# EAGLE design nix3SocketsFinal (EAGLE 9.2.2)
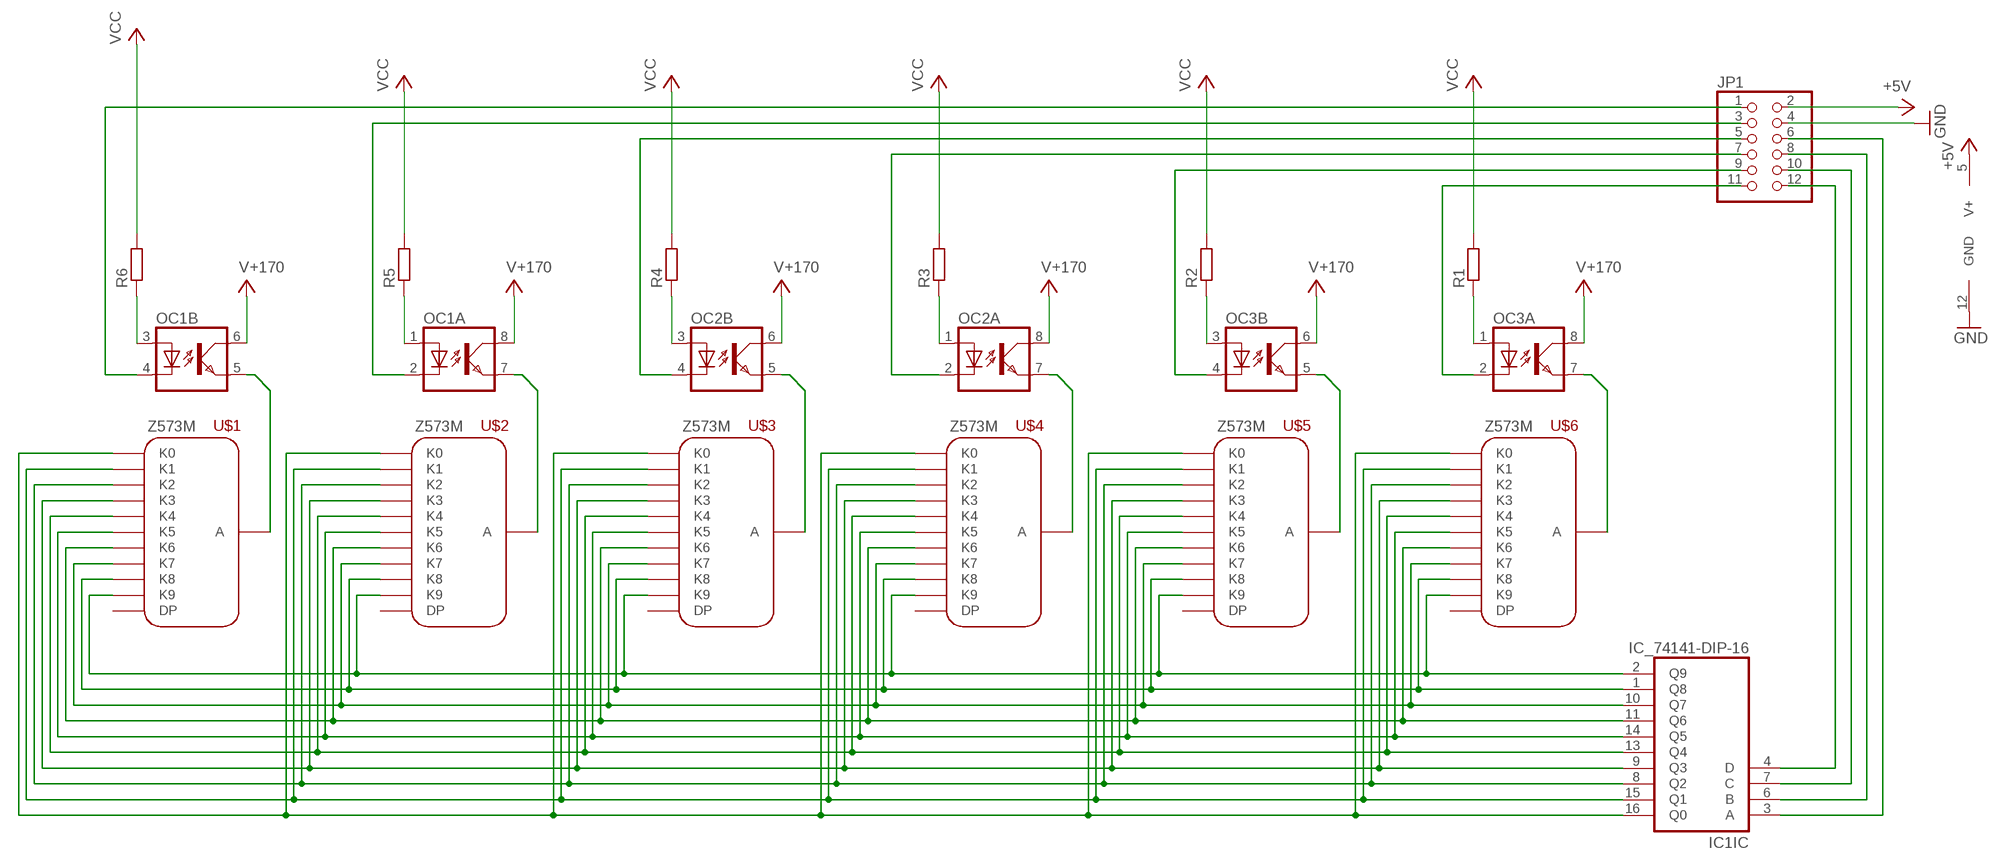
[diagram p0: schematic, sheet 1]

## Parts
IC1  IC_74141-DIP-16  [DIL16]
JP1  PINHD-2X6  [2X06]
OC1  ILD621  [DIL08]
OC2  ILD621  [DIL08]
OC3  ILD621  [DIL08]
R1  R-EU_R0805W  [R0805W]
R2  R-EU_R0805W  [R0805W]
R3  R-EU_R0805W  [R0805W]
R4  R-EU_R0805W  [R0805W]
R5  R-EU_R0805W  [R0805W]
R6  R-EU_R0805W  [R0805W]
U$1  Z573M  [Z573M]
U$2  Z573M  [Z573M]
U$3  Z573M  [Z573M]
U$4  Z573M  [Z573M]
U$5  Z573M  [Z573M]
U$6  Z573M  [Z573M]

## Nets
+5V: IC1.5(SUPPLY:V+) JP1.2 R1.2 R2.2 R3.2 R4.2 R5.2 R6.2 ; supply symbol labelled VCC
GND: IC1.12(SUPPLY:GND) JP1.4
N$2: IC1.2(IC:Q9) U$1.K9 U$2.K9 U$3.K9 U$4.K9 U$5.K9 U$6.K9
N$3: IC1.1(IC:Q8) U$1.K8 U$2.K8 U$3.K8 U$4.K8 U$5.K8 U$6.K8
N$4: IC1.10(IC:Q7) U$1.K7 U$2.K7 U$3.K7 U$4.K7 U$5.K7 U$6.K7
N$5: IC1.11(IC:Q6) U$1.K6 U$2.K6 U$3.K6 U$4.K6 U$5.K6 U$6.K6
N$6: IC1.14(IC:Q5) U$1.K5 U$2.K5 U$3.K5 U$4.K5 U$5.K5 U$6.K5
N$7: IC1.13(IC:Q4) U$1.K4 U$2.K4 U$3.K4 U$4.K4 U$5.K4 U$6.K4
N$8: IC1.9(IC:Q3) U$1.K3 U$2.K3 U$3.K3 U$4.K3 U$5.K3 U$6.K3
N$9: IC1.8(IC:Q2) U$1.K2 U$2.K2 U$3.K2 U$4.K2 U$5.K2 U$6.K2
N$10: IC1.15(IC:Q1) U$1.K1 U$2.K1 U$3.K1 U$4.K1 U$5.K1 U$6.K1
N$11: OC3.7(A:EMIT) U$6.A
N$12: IC1.16(IC:Q0) U$1.K0 U$2.K0 U$3.K0 U$4.K0 U$5.K0 U$6.K0
N$13: OC1.5(B:EMIT) U$1.A
N$14: OC1.7(A:EMIT) U$2.A
N$15: OC2.5(B:EMIT) U$3.A
N$16: OC2.7(A:EMIT) U$4.A
N$17: OC3.5(B:EMIT) U$5.A
N$18: JP1.11 OC3.2(A:C)
N$19: JP1.9 OC3.4(B:C)
N$20: JP1.7 OC2.2(A:C)
N$21: JP1.5 OC2.4(B:C)
N$22: JP1.3 OC1.2(A:C)
N$23: JP1.1 OC1.4(B:C)
N$24: IC1.4(IC:D) JP1.12
N$25: IC1.7(IC:C) JP1.10
N$26: IC1.6(IC:B) JP1.8
N$27: IC1.3(IC:A) JP1.6
N$28: OC1.3(B:A) R6.1
N$29: OC1.1(A:A) R5.1
N$30: OC2.3(B:A) R4.1
N$31: OC2.1(A:A) R3.1
N$32: OC3.3(B:A) R2.1
N$33: OC3.1(A:A) R1.1
V+: OC1.6(B:COL) OC1.8(A:COL) OC2.6(B:COL) OC2.8(A:COL) OC3.6(B:COL) OC3.8(A:COL) ; supply symbol labelled V+170
Unconnected: U$1.DP U$2.DP U$3.DP U$4.DP U$5.DP U$6.DP

## Library data of the parts
IC1 = dp_devices:IC_74141: BCD to decimal decoder
JP1 = pinhead:PINHD-2X6: PIN HEADER
OC1-OC3 = optocoupler:ILD621: SIEMENS OPTO COUPLER
R1-R6 = rcl:R-EU_: RESISTOR, European symbol
U$1-U$6 = nixie:Z573M: Z573M Nixie Tube - Designed by Mike Silverman - www.msilverman.me

## Board
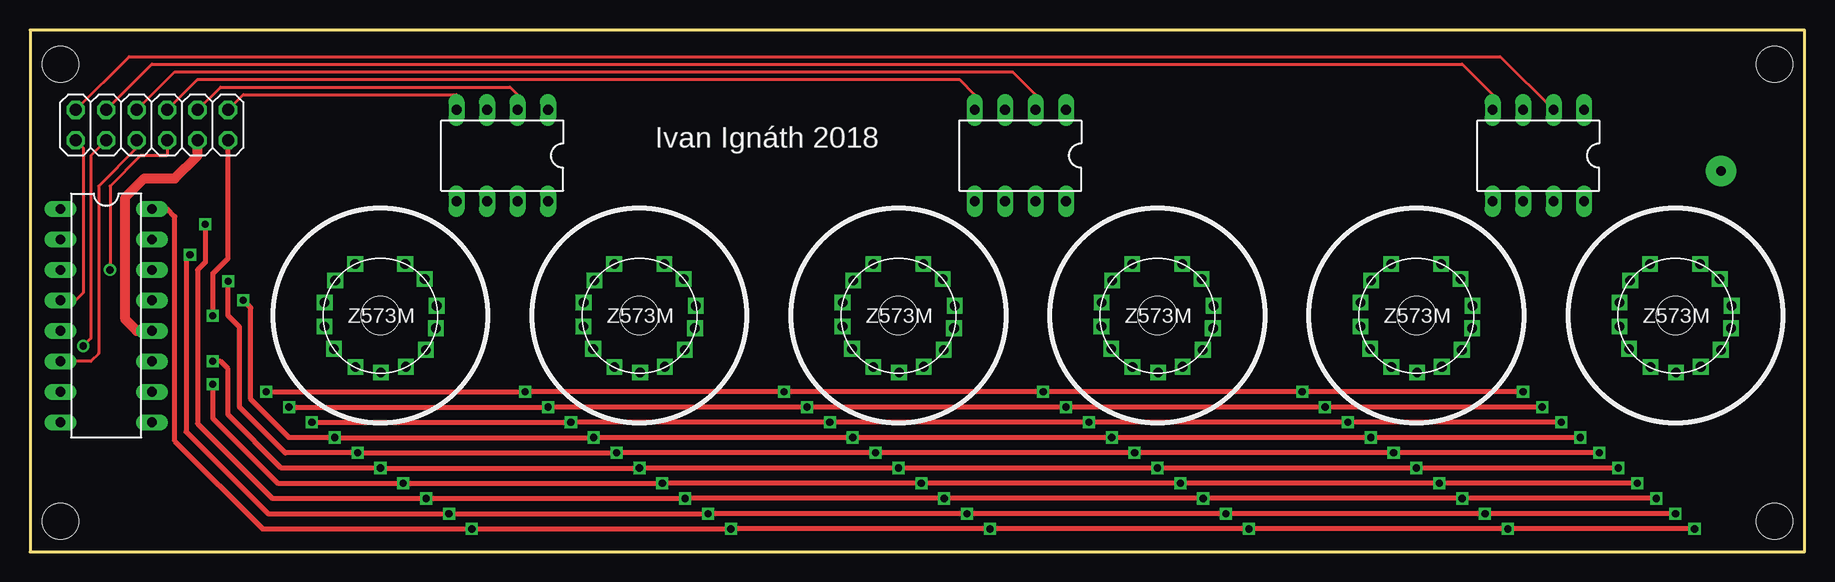
[diagram p1: board, top side]
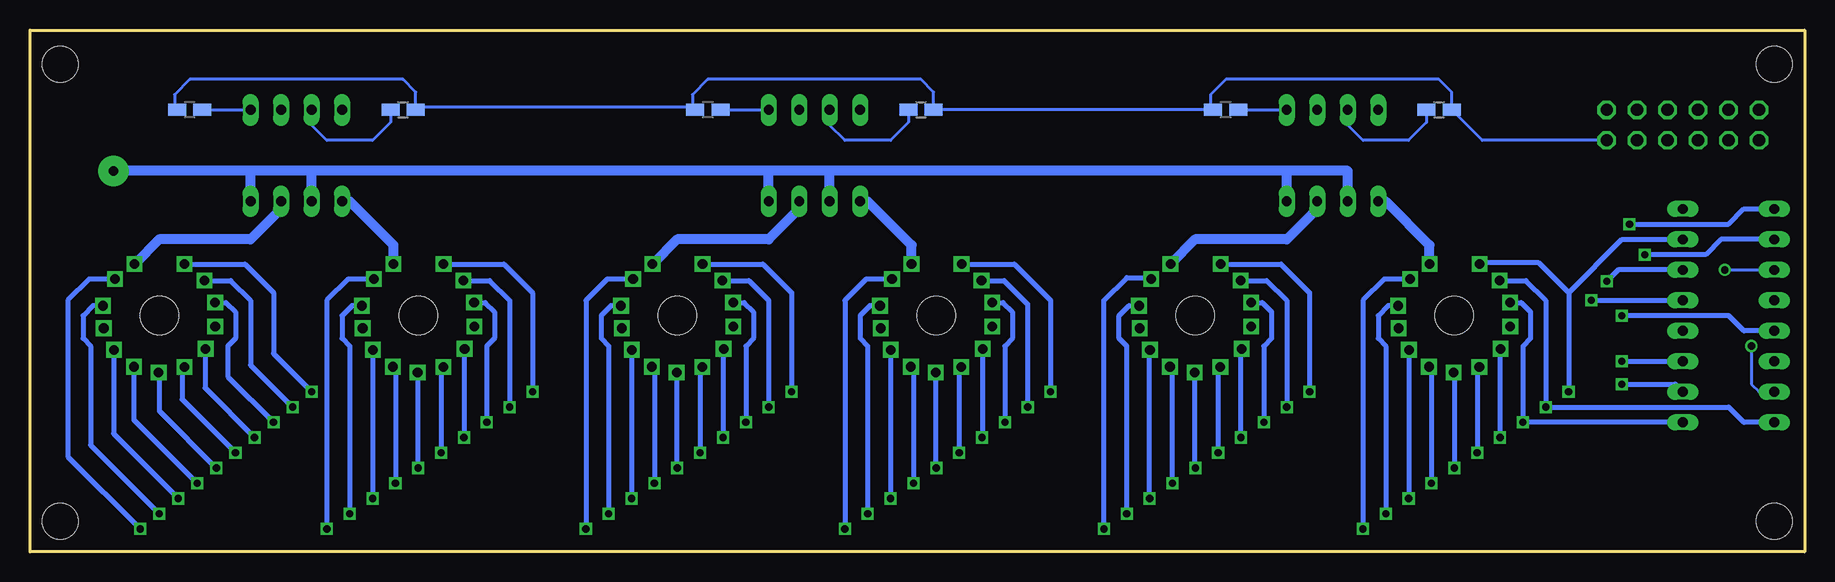
[diagram p2: board, bottom side, seen from below]

Size 147.94 x 43.48 mm. Coordinates in mm from the lower left corner, seen from the top.
Outline: 147.94,43.48 0,43.48 0,0 147.94,0 147.94,43.48
Copper layers (1*16): Top 0.035mm / dielectric 1.5mm / Bottom 0.035mm
Design rules "default *": minimum track width 10mil, minimum drill 0.3mm, track to track 8mil, track to pad 8mil, pad to pad 8mil, via to via 8mil, smd to smd 8mil, copper to edge 40mil, drill to drill 8mil, minimum pad ring 10mil, minimum via ring 8mil, stop-mask expansion 4mil, vias tented up to drill 0mil, thermal gap 10mil
Holes 3 mm at 2.54,40.64 145.41,2.54 145.41,40.64 2.54,2.54
Holes 3.2 mm at 29.21,19.68 50.8,19.68 72.39,19.68 93.98,19.68 115.57,19.68 137.16,19.68

### Footprints (pad centres in the part's own frame; a part is rotated, then mirrored left to right if it is on the bottom)
DIL16 = drill 0.813 long: 1 -8.89,-3.81; 2 -6.35,-3.81; 3 -3.81,-3.81; 4 -1.27,-3.81; 5 1.27,-3.81; 6 3.81,-3.81; 7 6.35,-3.81; 8 8.89,-3.81; 9 8.89,3.81; 10 6.35,3.81; 11 3.81,3.81; 12 1.27,3.81; 13 -1.27,3.81; 14 -3.81,3.81; 15 -6.35,3.81; 16 -8.89,3.81
2X06 = drill 1.016 octagon: 1 -6.35,-1.27; 2 -6.35,1.27; 3 -3.81,-1.27; 4 -3.81,1.27; 5 -1.27,-1.27; 6 -1.27,1.27; 7 1.27,-1.27; 8 1.27,1.27; 9 3.81,-1.27; 10 3.81,1.27; 11 6.35,-1.27; 12 6.35,1.27
DIL08 = drill 0.813 long: 1 -3.81,-3.81; 2 -1.27,-3.81; 3 1.27,-3.81; 4 3.81,-3.81; 5 3.81,3.81; 6 1.27,3.81; 7 -1.27,3.81; 8 -3.81,3.81
R0805W = smd 1.5 x 1: 1 -1.052,0; 2 1.052,0
Z573M = drill 0.8 square: A 2.064,4.296; DP 4.632,-1.052; IC -4.664,-0.9; K0 3.687,3.049; K1 -2.106,4.288; K2 -3.769,2.925; K3 -4.654,1.09; K4 -3.865,-2.77; K5 -2.087,-4.28; K6 0.052,-4.753; K7 2.115,-4.265; K8 3.783,-2.853; K9 4.689,0.821

### Placement (x,y rotation side)
IC1  6.35,19.68 270 top
JP1  10.16,35.56 180 top
OC1  39.37,33.02 180 top
OC2  82.55,33.02 180 top
OC3  125.73,33.02 180 top
R1  134.62,36.83 180 bottom
R2  116.84,36.83 0 bottom
R3  91.44,36.83 180 bottom
R4  73.66,36.83 0 bottom
R5  48.26,36.83 180 bottom
R6  30.48,36.83 0 bottom
U$1  29.21,19.68 0 top
U$2  50.8,19.68 0 top
U$3  72.39,19.68 0 top
U$4  93.98,19.68 0 top
U$5  115.57,19.68 0 top
U$6  137.16,19.68 0 top

### Tracks (layer width: path | path; a pad name or v marks a point on that pad's centre or on a via)
+5V  (via drill 0.6)
  Top 0.406: v15.24,19.68 15.24,23.18 16.51,24.45 JP1.2
  Bottom 0.254: 92.71,37.05 92.71,38.1 91.44,39.37 73.66,39.37 72.61,38.32 R4.2 R5.2 49.53,37.05 49.53,38.1 48.26,39.37 30.48,39.37 29.43,38.32 R6.2 26.89,34.29 JP1.2 | 92.71,37.05 R3.2 | 92.71,37.05 115.57,37.05 R2.2 115.79,38.32 116.84,39.37 134.62,39.37 135.89,38.1 135.89,37.05 R1.2
  Bottom 0.406: IC1.5 5.08,18.41 6.35,19.68 v15.24,19.68
GND
  Top 0.813: IC1.12 8.89,18.41 7.94,19.37 7.94,29.53 9.53,31.11 12.06,31.11 13.97,33.02 JP1.4
N$2  (via drill 0.6)
  Top 0.406: v137.16,3.17 v121.28,3.17 v99.69,3.17 v78.11,3.17 v56.52,3.17 v34.92,3.17 19.84,3.17 13.02,10 13.02,24.45 v13.34,24.77
  Bottom 0.406: U$1.K9 34.74,20.51 35.56,19.68 35.56,17.78 34.92,17.14 v34.92,3.17 | v56.52,3.17 56.52,17.14 57.15,17.78 57.15,19.68 56.33,20.51 U$2.K9 | U$3.K9 77.92,20.51 78.74,19.68 78.74,17.78 78.11,17.14 v78.11,3.17 | U$4.K9 99.51,20.51 100.33,19.68 100.33,17.78 99.69,17.14 v99.69,3.17 | U$5.K9 121.1,20.51 121.92,19.68 121.92,17.78 121.28,17.14 v121.28,3.17 | U$6.K9 142.69,20.51 143.51,19.68 143.51,17.78 142.88,17.14 142.88,8.89 v137.16,3.17 | IC1.2 6.99,26.04 8.26,24.77 v13.34,24.77
N$3  (via drill 0.6)
  Top 0.406: v135.57,4.45 v119.38,4.45 v97.79,4.45 v76.2,4.45 v54.61,4.45 v33.02,4.45 20.2,4.45 13.97,10.68 13.97,23.5 14.61,24.13 v14.61,27.3
  Bottom 0.406: U$1.K8 32.99,4.47 v33.02,4.45 | v54.61,4.45 54.61,16.8 U$2.K8 | U$3.K8 76.2,16.8 v76.2,4.45 | U$4.K8 97.79,16.8 v97.79,4.45 | U$5.K8 119.38,16.8 v119.38,4.45 | U$6.K8 140.97,16.8 140.97,9.84 v135.57,4.45 | v14.61,27.3 6.35,27.3 5.08,28.57 IC1.1
N$4  (via drill 0.6)
  Top 0.406: v133.99,5.71 v117.47,5.71 v95.89,5.71 v74.3,5.71 v52.7,5.71 v31.11,5.71 20.64,5.71 15.24,11.11 v15.24,13.97
  Bottom 0.406: U$1.K7 31.11,15.42 v31.11,5.71 | v52.7,5.71 52.7,15.21 U$2.K7 | U$3.K7 74.3,15.21 v74.3,5.71 | U$4.K7 95.89,15.21 v95.89,5.71 | U$5.K7 117.47,15.21 v117.47,5.71 | v15.24,13.97 10.79,13.97 IC1.10 | U$6.K7 139.28,11.01 v133.99,5.71
N$5  (via drill 0.6)
  Top 0.406: v132.4,6.99 v115.57,6.99 v93.98,6.99 v72.39,6.99 v50.8,6.99 v29.21,6.99 20.95,6.99 16.51,11.43 16.51,15.24 15.88,15.88 v15.24,15.88
  Bottom 0.406: U$1.K6 29.21,14.88 v29.21,6.99 | U$6.K6 137.16,14.88 137.16,11.75 v132.4,6.99 | v15.24,15.88 IC1.11 | U$2.K6 50.85,7.04 v50.8,6.99 | U$3.K6 72.44,7.04 v72.39,6.99 | U$4.K6 94.03,7.04 v93.98,6.99 | U$5.K6 115.62,7.04 v115.57,6.99
N$6  (via drill 0.6)
  Top 0.406: v130.81,8.26 v113.67,8.26 v92.08,8.26 v70.48,8.26 v48.9,8.26 v27.3,8.26 21.27,8.26 17.46,12.06 17.46,18.73 16.51,19.68 v16.51,22.54
  Bottom 0.406: U$1.K5 27.3,15.22 v27.3,8.26 | U$3.K5 70.48,15.22 v70.48,8.26 | U$4.K5 92.08,15.22 v92.08,8.26 | U$5.K5 113.67,15.22 v113.67,8.26 | U$6.K5 135.25,15.22 135.25,12.7 v130.81,8.26 | IC1.14 15.56,23.5 v16.51,22.54 | U$2.K5 48.9,15.22 v48.9,8.26
N$7  (via drill 0.6)
  Top 0.406: v129.22,9.53 v111.76,9.53 v90.17,9.53 v68.58,9.53 v46.99,9.53 v25.4,9.53 21.59,9.53 18.41,12.7 18.41,20.32 v17.78,20.95
  Bottom 0.406: U$1.K4 25.4,16.86 v25.4,9.53 | v46.99,9.53 46.99,16.86 U$2.K4 | U$3.K4 68.53,9.58 v68.58,9.53 | U$4.K4 90.11,16.57 90.17,16.51 v90.17,9.53 | U$5.K4 111.7,16.57 111.76,16.51 v111.76,9.53 | U$6.K4 133.29,16.57 133.35,16.51 133.35,13.65 v129.22,9.53 | v17.78,20.95 IC1.13
N$8  (via drill 0.6)
  Top 0.406: v23.5,10.79 v45.09,10.79 v66.67,10.79 v88.27,10.79 v109.86,10.79 v127.64,10.79
  Bottom 0.406: U$3.K3 66.81,20.77 66.04,20 66.04,17.78 66.67,17.14 v66.67,10.79 | v45.09,10.79 45.09,17.14 44.45,17.78 44.45,20 45.22,20.77 U$2.K3 | U$4.K3 88.4,20.77 87.63,20 87.63,17.78 88.27,17.14 v88.27,10.79 | U$5.K3 109.99,20.77 109.22,20 109.22,17.78 109.86,17.14 v109.86,10.79 | U$6.K3 131.58,20.77 130.81,20 130.81,17.78 131.44,17.14 131.44,14.61 v127.64,10.79 | IC1.9 v23.5,10.79 23.5,17.14 22.86,17.78 22.86,20 23.63,20.77 U$1.K3
N$9  (via drill 0.6)
  Top 0.406: v21.59,12.06 v43.18,12.06 v64.77,12.06 v86.36,12.06 v107.95,12.06 v126.05,12.06
  Bottom 0.406: U$3.K2 66.74,22.61 64.77,20.64 v64.77,12.06 | U$2.K2 44.84,22.61 43.18,20.95 v43.18,12.06 | U$1.K2 23.25,22.61 21.59,20.95 v21.59,12.06 6.35,12.06 5.08,10.79 IC1.8 | U$4.K2 88.02,22.61 86.36,20.95 v86.36,12.06 | U$5.K2 109.61,22.61 107.95,20.95 v107.95,12.06 | U$6.K2 131.19,22.61 129.54,20.95 129.54,15.56 v126.05,12.06
N$10  (via drill 0.6)
  Top 0.406: v19.68,13.34 v41.27,13.34 v62.87,13.34 v84.45,13.34 v106.05,13.34 v124.46,13.34
  Bottom 0.406: U$3.K1 65.88,23.97 62.87,20.95 v62.87,13.34 | U$4.K1 86.84,23.97 84.45,21.59 v84.45,13.34 | U$5.K1 108.43,23.97 106.05,21.59 v106.05,13.34 | U$6.K1 130.02,23.97 127.64,21.59 127.64,16.51 v124.46,13.34 | 19.68,21.59 22.23,24.13 26.95,24.13 U$1.K1 | 19.68,21.59 v19.68,13.34 | U$2.K1 43.66,23.97 41.27,21.59 v41.27,13.34 | 19.68,21.59 15.24,26.04 IC1.15
N$11
  Bottom 0.813: OC3.7 127,28.57 129.54,26.04 137.17,26.04 U$6.A
N$12  (via drill 0.6)
  Top 0.406: v138.75,1.91 v123.19,1.91 v101.6,1.91 v80.01,1.91 v58.42,1.91 v36.83,1.91 19.39,1.91 12.06,9.23 12.06,27.94 11.43,28.57 IC1.16
  Bottom 0.406: U$1.K0 35.05,22.73 36.83,20.95 v36.83,1.91 | v58.42,1.91 58.42,20.95 56.52,22.86 54.61,22.86 U$2.K0 | U$3.K0 78.23,22.73 80.01,20.95 v80.01,1.91 | U$4.K0 99.82,22.73 101.6,20.95 v101.6,1.91 | U$5.K0 121.41,22.73 123.19,20.95 v123.19,1.91 | U$6.K0 143,22.73 144.78,20.95 144.78,7.94 v138.75,1.91
N$13
  Bottom 0.813: U$1.A 31.27,25.56 34.92,29.21 OC1.5
N$14
  Bottom 0.813: OC1.7 40.64,28.57 43.18,26.04 50.81,26.04 U$2.A
N$15
  Bottom 0.813: U$3.A 74.45,25.56 78.11,29.21 OC2.5
N$16
  Bottom 0.813: OC2.7 83.82,28.57 86.36,26.04 93.99,26.04 U$4.A
N$17
  Bottom 0.813: U$5.A 117.63,25.56 121.28,29.21 OC3.5
N$18
  Top 0.254: JP1.11 8.26,41.27 122.56,41.27 OC3.2
N$19
  Top 0.254: JP1.9 10.16,40.64 119.38,40.64 121.92,38.1 OC3.4
N$20
  Top 0.254: JP1.7 12.06,40.01 81.92,40.01 83.82,38.1 OC2.2
N$21
  Top 0.254: JP1.5 13.97,39.37 77.47,39.37 78.74,38.1 OC2.4
N$22
  Top 0.254: JP1.3 15.88,38.73 40.01,38.73 40.64,38.1 OC1.2
N$23
  Top 0.254: JP1.1 17.78,38.1 35.56,38.1 OC1.4
N$24
  Top 0.254: JP1.12 4.45,33.66 4.45,21.59 3.81,20.95 IC1.4
N$25  (via drill 0.61)
  Top 0.254: v4.45,17.14 5.08,17.78 5.08,33.02 JP1.10
  Bottom 0.254: v4.45,17.14 4.45,13.97 3.81,13.34 IC1.7
N$26
  Top 0.254: JP1.8 8.89,33.66 5.71,30.48 5.71,16.51 5.08,15.88 IC1.6
N$27  (via drill 0.61)
  Top 0.254: JP1.6 11.43,33.02 9.21,33.02 6.67,30.48 v6.67,23.5
  Bottom 0.254: v6.67,23.5 IC1.3
N$28
  Bottom 0.254: R6.1 31.53,35.78 33.02,34.29 36.83,34.29 38.1,35.56 OC1.3
N$29
  Bottom 0.254: R5.1 OC1.1
N$30
  Bottom 0.254: R4.1 74.71,35.78 76.2,34.29 80.01,34.29 81.28,35.56 OC2.3
N$31
  Bottom 0.254: R3.1 OC2.1
N$32
  Bottom 0.254: R2.1 117.89,35.78 119.38,34.29 123.19,34.29 124.46,35.56 OC3.3
N$33
  Bottom 0.254: R1.1 OC3.1
V+  (via drill 0.8 pad 2.54)
  Bottom 0.813: OC1.6 38.1,31.75 43.18,31.75 | OC1.8 43.18,31.75 | 43.18,31.75 81.28,31.75 | OC2.6 81.28,31.75 | 81.28,31.75 86.36,31.75 | OC2.8 86.36,31.75 | 86.36,31.75 124.46,31.75 | OC3.6 124.46,31.75 | 124.46,31.75 129.54,31.75 | 129.54,31.75 v140.97,31.75 | OC3.8 129.54,31.75

### Text on the board
tNames: Ivan Ignáth 2018